# Altium project 智能车双电机版本2.PrjPcb
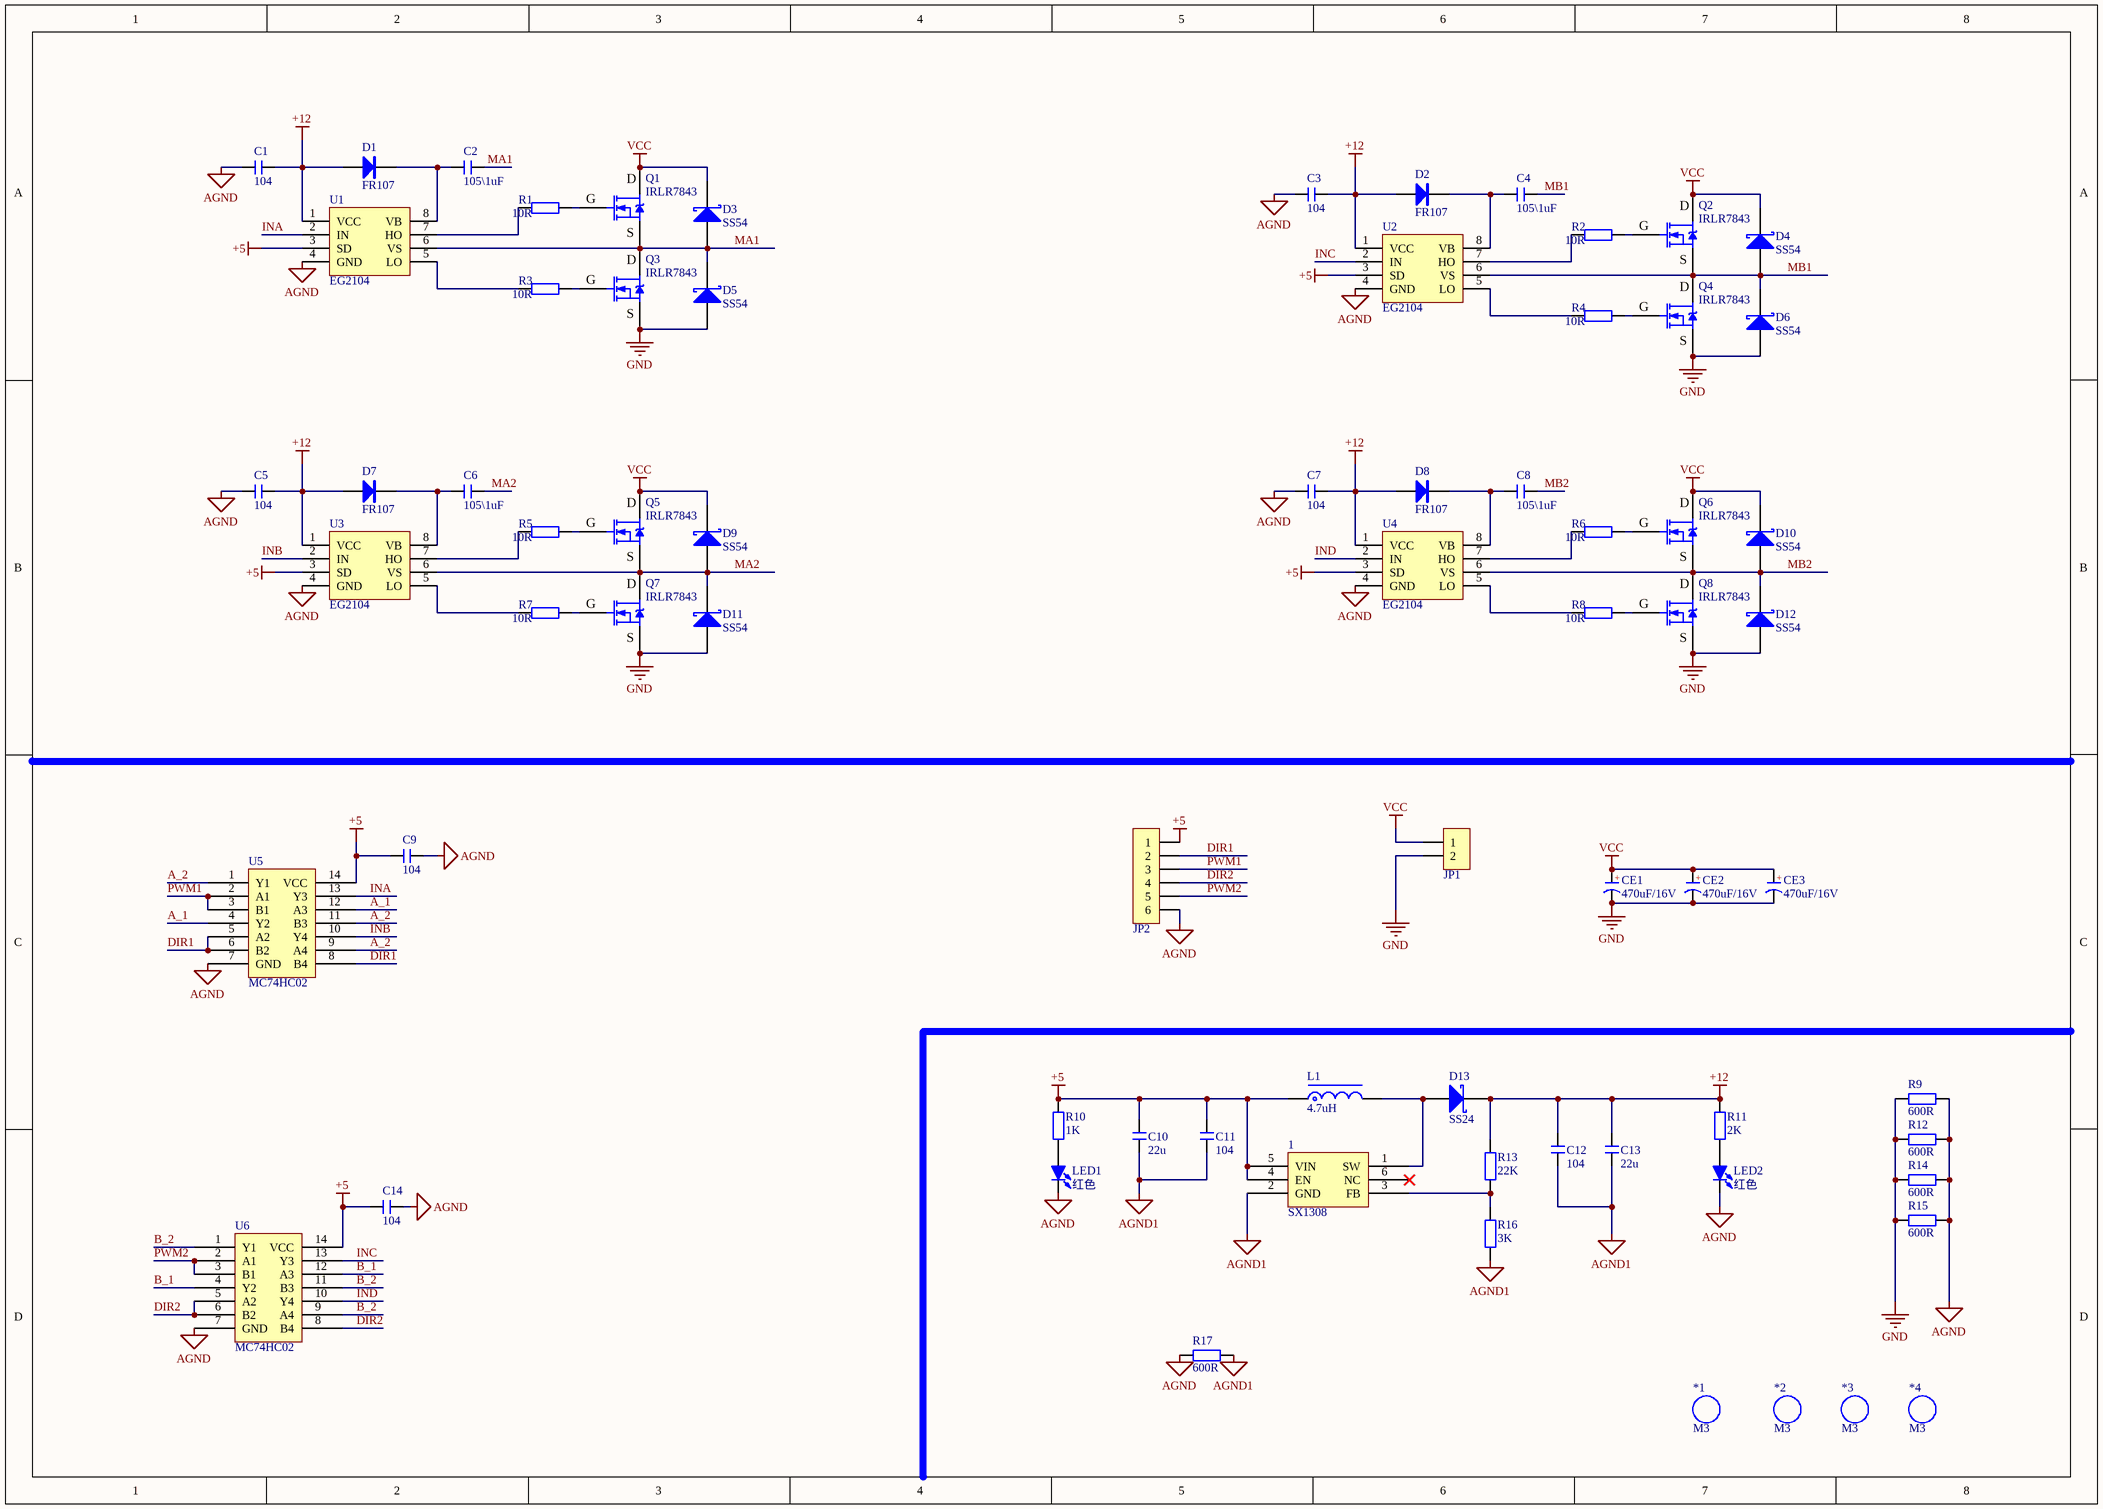
[diagram p0: 双电机驱动版本2.SchDoc]
1 sheet, 71 parts. Net scope: global (net labels, ports and power ports of the same name join across sheets).
Board file: 双电机驱动版本2.PcbDoc

## Sheet 双电机驱动版本2.SchDoc
size A3; SheetNumber: 1; SheetTotal: 1

### Parts
1  SX1308  [SOT23-6L]
*1  M3  [M3 125X200]
*2  M3  [M3 125X200]
*3  M3  [M3 125X200]
*4  M3  [M3 125X200]
C1  104  [C 0805_L]
C2  105\1uF  [C 0805_L]
C3  104  [C 0805_L]
C4  105\1uF  [C 0805_L]
C5  104  [C 0805_L]
C6  105\1uF  [C 0805_L]
C7  104  [C 0805_L]
C8  105\1uF  [C 0805_L]
C9  104  [C 0603_L]
C10  22u  [C 0805_L]
C11  104  [C 0603_L]
C12  104  [C 0603_L]
C13  22u  [C 0805_L]
C14  104  [C 0603_L]
CE1  470uF/16V  [CAP 3*8*12]
CE2  470uF/16V  [CAP 3*8*12]
CE3  470uF/16V  [CAP 3*8*12]
D1  FR107  [SOD-123]
D2  FR107  [SOD-123]
D3  SS54  [SMA]
D4  SS54  [SMA]
D5  SS54  [SMA]
D6  SS54  [SMA]
D7  FR107  [SOD-123]
D8  FR107  [SOD-123]
D9  SS54  [SMA]
D10  SS54  [SMA]
D11  SS54  [SMA]
D12  SS54  [SMA]
D13  SS24  [SMA]
JP1  HDR-1X2  [XT30-M]  (value not drawn)
JP2  HDR-1X6  [XH2.54-WI-6P]  (value not drawn)
L1  4.7uH  [CD43]
LED1  红色  [LED 0603G]
LED2  红色  [LED 0603R]
Q1  IRLR7843  [TO252]
Q2  IRLR7843  [TO252]
Q3  IRLR7843  [TO252]
Q4  IRLR7843  [TO252]
Q5  IRLR7843  [TO252]
Q6  IRLR7843  [TO252]
Q7  IRLR7843  [TO252]
Q8  IRLR7843  [TO252]
R1  10R  [R 0603_L]
R2  10R  [R 0603_L]
R3  10R  [R 0603_L]
R4  10R  [R 0603_L]
R5  10R  [R 0603_L]
R6  10R  [R 0603_L]
R7  10R  [R 0603_L]
R8  10R  [R 0603_L]
R9  600R  [R 0603_L]
R10  1K  [R 0603_L]
R11  2K  [R 0603_L]
R12  600R  [R 0603_L]
R13  22K  [R 0603_L]
R14  600R  [R 0603_L]
R15  600R  [R 0603_L]
R16  3K  [R 0603_L]
R17  600R  [R 0603_L]
U1  EG2104  [SOP8]
U2  EG2104  [SOP8]
U3  EG2104  [SOP8]
U4  EG2104  [SOP8]
U5  MC74HC02  [SOP14_N]
U6  MC74HC02  [SOP14_N]

### Nets
+5: 1.4(EN) 1.5(VIN) C9.1 C10.2 C11.2 C14.1 JP2.1 L1.1 R10.2 U1.3(SD) U2.3(SD) U3.3(SD) U4.3(SD) U5.14(VCC) U6.14(VCC)
+12: C1.2 C3.2 C5.2 C7.2 C12.2 C13.2 D1.1(A) D2.1(A) D7.1(A) D8.1(A) D13.2(K) R11.2 R13.2 U1.1(VCC) U2.1(VCC) U3.1(VCC) U4.1(VCC)
AGND: C1.1 C3.1 C5.1 C7.1 C9.2 C14.2 JP2.6 LED1.2(K) LED2.2(K) R9.2 R12.2 R14.2 R15.2 R17.1 U1.4(GND) U2.4(GND) U3.4(GND) U4.4(GND) U5.7(GND) U6.7(GND)
AGND1: 1.2(GND) C10.1 C11.1 C12.1 C13.1 R16.1 R17.2
GND: CE1.2(K) CE2.2(K) CE3.2(K) D5.1(A) D6.1(A) D11.1(A) D12.1(A) JP1.2 Q3.3(S) Q4.3(S) Q7.3(S) Q8.3(S) R9.1 R12.1 R14.1 R15.1
VCC: CE1.1(A) CE2.1(A) CE3.1(A) D3.2(K) D4.2(K) D9.2(K) D10.2(K) JP1.1 Q1.2(D) Q2.2(D) Q5.2(D) Q6.2(D)
A_1: U5.4(Y2) U5.12(A3)
A_2: U5.1(Y1) U5.9(A4) U5.11(B3)
B_1: U6.4(Y2) U6.12(A3)
B_2: U6.1(Y1) U6.9(A4) U6.11(B3)
DIR1: JP2.2 U5.5(A2) U5.6(B2) U5.8(B4)
DIR2: JP2.4 U6.5(A2) U6.6(B2) U6.8(B4)
INA: U1.2(IN) U5.13(Y3)
INB: U3.2(IN) U5.10(Y4)
INC: U2.2(IN) U6.13(Y3)
IND: U4.2(IN) U6.10(Y4)
MA1: C2.1 D3.1(A) D5.2(K) Q1.3(S) Q3.2(D) U1.6(VS)
MA2: C6.1 D9.1(A) D11.2(K) Q5.3(S) Q7.2(D) U3.6(VS)
MB1: C4.1 D4.1(A) D6.2(K) Q2.3(S) Q4.2(D) U2.6(VS)
MB2: C8.1 D10.1(A) D12.2(K) Q6.3(S) Q8.2(D) U4.6(VS)
PWM1: JP2.3 U5.2(A1) U5.3(B1)
PWM2: JP2.5 U6.2(A1) U6.3(B1)
Net1_1: 1.1(SW) D13.1(A) L1.2
Net1_3: 1.3(FB) R13.1 R16.2
NetC2_2: C2.2 D1.2(K) U1.8(VB)
NetC4_2: C4.2 D2.2(K) U2.8(VB)
NetC6_2: C6.2 D7.2(K) U3.8(VB)
NetC8_2: C8.2 D8.2(K) U4.8(VB)
NetLED1_1: LED1.1(A) R10.1
NetLED2_1: LED2.1(A) R11.1
NetQ1_1: Q1.1(G) R1.1
NetQ2_1: Q2.1(G) R2.1
NetQ3_1: Q3.1(G) R3.1
NetQ4_1: Q4.1(G) R4.1
NetQ5_1: Q5.1(G) R5.1
NetQ6_1: Q6.1(G) R6.1
NetQ7_1: Q7.1(G) R7.1
NetQ8_1: Q8.1(G) R8.1
NetR1_2: R1.2 U1.7(HO)
NetR2_2: R2.2 U2.7(HO)
NetR3_2: R3.2 U1.5(LO)
NetR4_2: R4.2 U2.5(LO)
NetR5_2: R5.2 U3.7(HO)
NetR6_2: R6.2 U4.7(HO)
NetR7_2: R7.2 U3.5(LO)
NetR8_2: R8.2 U4.5(LO)

Not connected (* = marked no-connect by the designer): 1 6(NC)*

### Notes on the sheet
- (in symbol CE) +

### Library data of the parts
*1-*4 = M3: 铜柱孔; 版权归属: 封装库来自淘宝 ID：黄晶宝石; BOM名称: 铜柱孔; 学习资源: https://shop463601444.taobao.com
C1-C14 = C: 贴片电容; BOM名称: 无极性贴片电容; 淘宝ID: 封装库来自淘宝 ID：黄晶宝石; 联系售后，技术支持: https://shop463601444.taobao.com; 唯一出售店铺网址: https://shop463601444.taobao.com
CE1-CE3 = CE: 直插电解电容; 淘宝ID: 封装库来自淘宝 ID：黄晶宝石; BOM名称: 直插电解电容; 联系售后: https://shop463601444.taobao.com
D1 D2 D7 D8 = FR107: 快恢复整流二极管; BOM名称: 快恢复二极管; 版权归属: 封装库来自淘宝 ID：黄晶宝石; 属性: 700V/1A; 学习资源: https://shop463601444.taobao.com
D3-D6 D9-D12 = SS34: 肖特基二极管; 属性: 40V/3A; BOM名称: 肖特基二极管; 封装库来自淘宝 ID：黄晶宝石: https://shop463601444.taobao.com
D13 = SS14: 肖特基二极管; 属性: 40V/1A; BOM名称: 肖特基二极管; 封装库来自淘宝 ID：黄晶宝石: https://shop463601444.taobao.com
JP1 = Header 2: 2P接插件; 版权归属: 封装库来自淘宝卖家 ID：黄晶宝石; BOM名称: 2P接插件; 学习资源: https://shop463601444.taobao.com
JP2 = Header 6: 6P接插件; 版权归属: 封装库来自淘宝 ID：黄晶宝石; BOM名称: 6P接插件; 学习资源: https://shop463601444.taobao.com
L1 = L-SMD: CD系列贴片线绕功率电感; BOM名称: 功率电感; 淘宝ID: 封装库来自淘宝 ID：黄晶宝石; 学习资源: www.ooocke.com
LED1 LED2 = LED-SMD: 贴片LED; 版权归属: 封装库来自淘宝 ID：黄晶宝石; BOM名称: 贴片LED; 学习资源: https://shop463601444.taobao.com
Q1-Q8 = IRF3710: N沟场效应管; 版权归属: 封装库来自淘宝 ID：黄晶宝石; BOM名称: N沟场效应管; 技术支持，联系售后: https://shop463601444.taobao.com
R1-R8 R10 R11 R13 R16 = R: 贴片电阻; 版权归属: 来自淘宝 ID：黄晶宝石; 封装库来自淘宝卖家 ID：黄晶宝石: 其他店铺购入均为盗版，不享受售后技术支持服务，请立即申请退款; BOM名称: 贴片电阻; 联系售后: https://shop463601444.taobao.com
R9 R12 R14 R15 R17 = R: 磁珠; BOM名称: 贴片电阻; 版权归属: 来自淘宝 ID：黄晶宝石; 封装库来自淘宝卖家 ID：黄晶宝石: 其他店铺购入均为盗版，不享受售后技术支持服务，请立即申请退款; 联系售后: https://shop463601444.taobao.com
U1-U4 = EG2104: 半桥驱动芯片
U5 U6 = MC74HC02: 或非门